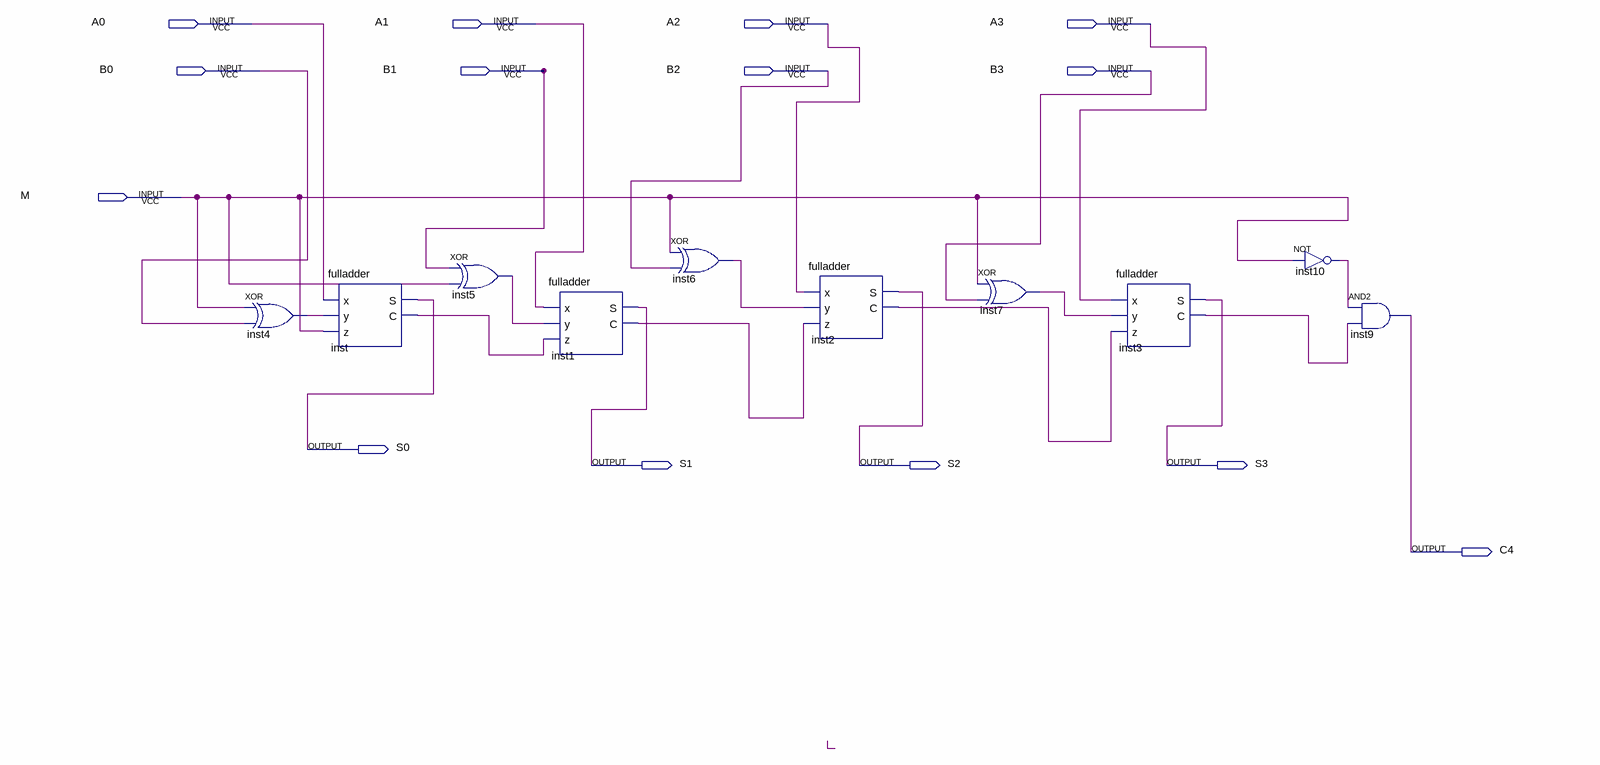
[diagram p0: schematic sheet]
// Quartus schematic fourbitaddersubstractor.bdf as structural Verilog: 10 symbols, 14 pins
module fourbitaddersubstractor (
  input  A0,
  input  A1,
  input  A2,
  input  A3,
  input  B0,
  input  B1,
  input  B2,
  input  B3,
  input  M,
  output S0,
  output S1,
  output S2,
  output S3,
  output C4
);

  wire inst1_c, inst2_c, inst3_c, inst4_out, inst5_out, inst6_out, inst7_out, inst10_out, inst_c;

  xor inst4 (inst4_out, M, B0);
  fulladder inst (.x(A0), .y(inst4_out), .z(M), .S(S0), .C(inst_c));
  xor inst5 (inst5_out, B1, M);
  fulladder inst1 (.x(A1), .y(inst5_out), .z(inst_c), .S(S1), .C(inst1_c));
  xor inst6 (inst6_out, M, B2);
  fulladder inst2 (.x(A2), .y(inst6_out), .z(inst1_c), .S(S2), .C(inst2_c));
  xor inst7 (inst7_out, M, B3);
  fulladder inst3 (.x(A3), .y(inst7_out), .z(inst2_c), .S(S3), .C(inst3_c));
  not inst10 (inst10_out, M);
  and inst9 (C4, inst10_out, inst3_c);
endmodule
